# EasyEDA Pro project 复活吧！我们的平衡车！3.30修改后版本.eprj

# Schematic Schematic1
Board Name: Board1; Create Date: 2025-03-22; Page Name: P1; Project Name: 复活吧！我们的平衡车！; Schematic Name: Schematic1; Update Date: 2025-03-22; Company: 嘉立创EDA; Page Size: A4; Version: V1.0
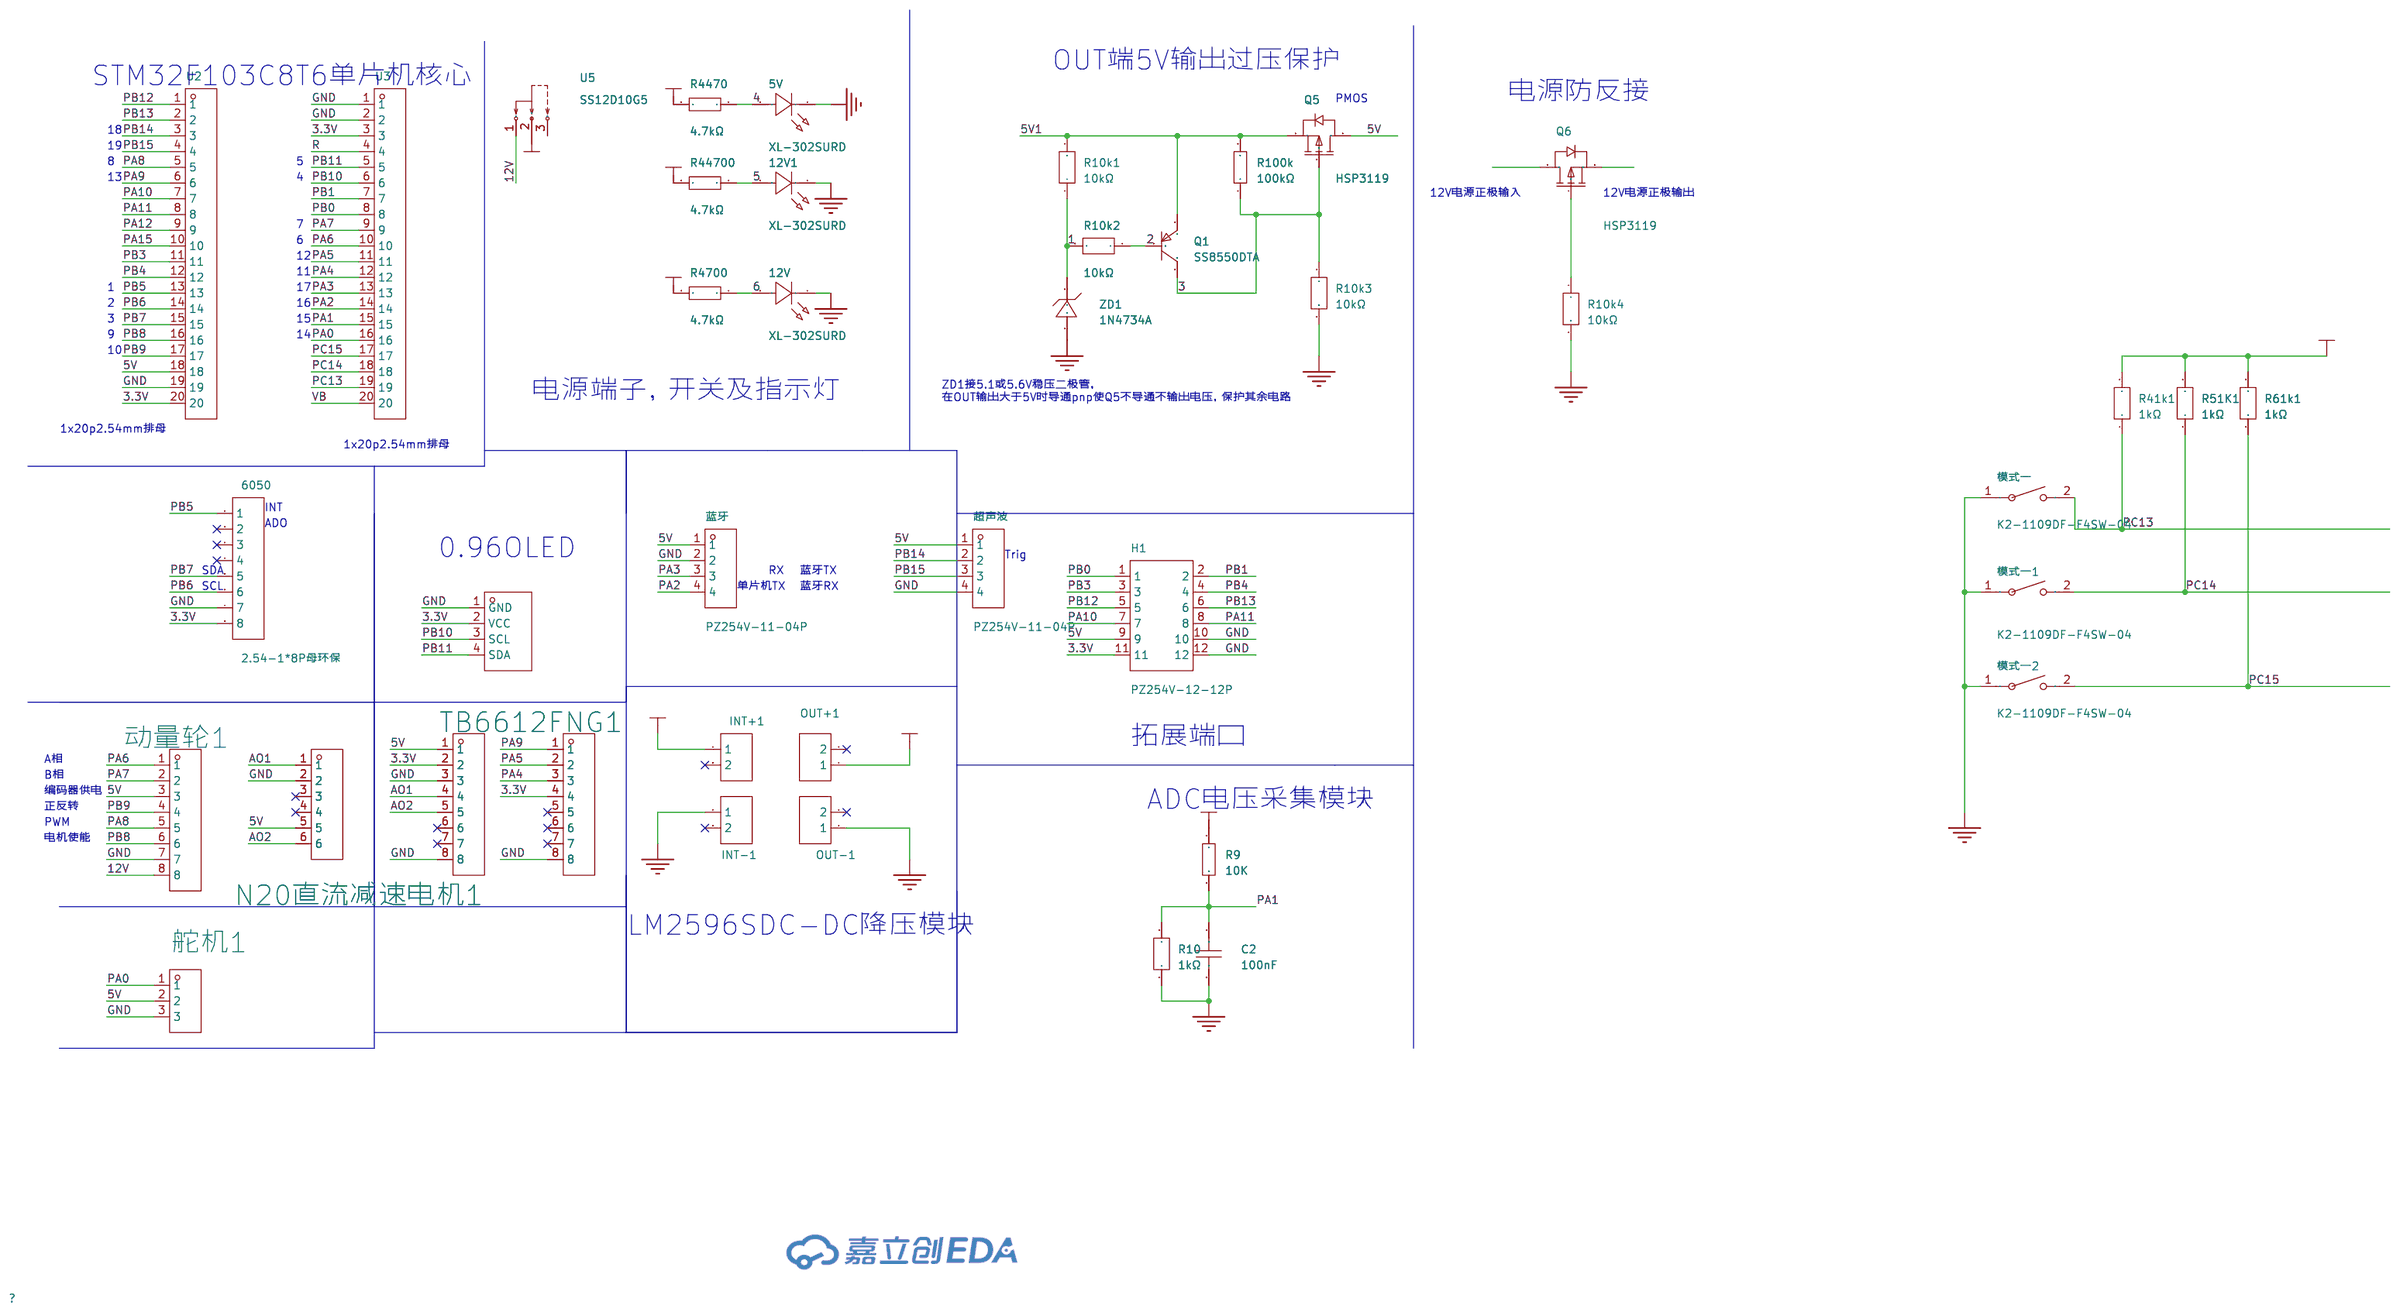
[diagram p0: schematic sheet]

## Parts
5V  XL-302SURD  [LED-TH_BD3.8-P2.54-RD]
12V  XL-302SURD  [LED-TH_BD3.8-P2.54-RD]
12V1  XL-302SURD  [LED-TH_BD3.8-P2.54-RD]
6050  2.54-1*8P母环保  [HDR-TH_8P-P2.54-V-F-1]
C2  100nF  [rad-0.1]
H1  PZ254V-12-12P  [HDR-TH_12P-P2.54-V-M-R2-C6-S2.54]
INT+1  2.54-1*2P母  [HDR-TH_2P-P2.54-V-F]
INT-1  2.54-1*2P母  [HDR-TH_2P-P2.54-V-F]
N20直流减速电机1  KH-2PH90-1X6P-L10.5  [hdr-th_6p-p2.54-v-f]
OLED1  HS96L03W2C03  [OLED-TH_L27.8-W27.2-P2.54_C9900033791]
OUT+1  2.54-1*2P母  [HDR-TH_2P-P2.54-V-F]
OUT-1  2.54-1*2P母  [HDR-TH_2P-P2.54-V-F]
Q1  SS8550DTA  [TO-92-3_L4.8-W3.7-P2.54-L]
Q5  HSP3119  [TO-220-3_L10.2-W4.5-P2.54-L-1]
Q6  HSP3119  [TO-220-3_L10.2-W4.5-P2.54-L-1]
R9  10K  [RES-TH_BD2.3-L6.5-P10.50-D0.5]
R10  1kΩ  [RES-TH_BD2.3-L6.5-P10.50-D0.5]
R10k1  10kΩ  [RES-TH_BD2.4-L6.3-P10.30-D0.6]
R10k2  10kΩ  [RES-TH_BD2.4-L6.3-P10.30-D0.6]
R10k3  10kΩ  [RES-TH_BD2.4-L6.3-P10.30-D0.6]
R10k4  10kΩ  [RES-TH_BD2.4-L6.3-P10.30-D0.6]
R41k1  1kΩ  [RES-TH_BD2.3-L6.5-P10.50-D0.5]
R51K1  1kΩ  [RES-TH_BD2.3-L6.5-P10.50-D0.5]
R61k1  1kΩ  [RES-TH_BD2.3-L6.5-P10.50-D0.5]
R100k  100kΩ  [RES-TH_BD2.7-L6.2-P10.20-D0.4]
R4470  4.7kΩ  [RES-TH_BD2.3-L6.5-P10.50-D0.5]
R4700  4.7kΩ  [RES-TH_BD2.3-L6.5-P10.50-D0.5]
R44700  4.7kΩ  [RES-TH_BD2.3-L6.5-P10.50-D0.5]
TB1  2.54-1*8P/30mm(3+24+3)  [hdr-th_8p-p2.54-v-f]
TB6612FNG1  2.54-1*8P/30mm(3+24+3)  [HDR-TH_8P-P2.54-V-M-4]
U2  KH-2FH-1X20P-H4.3  [hdr-th_20p-p2.54-v-f]
U3  KH-2FH-1X20P-H4.3  [hdr-th_20p-p2.54-v-f]
U5  SS12D10G5  [SW-TH_SHOU-HAN_SS12D10G4]
ZD1  1N4734A  [DO-41_BD2.8-L4.2-P8.00-D0.7-FD]
动量轮1  2.54-1*8P/30mm(3+24+3)  [hdr-th_8p-p2.54-v-f]
模式一  K2-1109DF-F4SW-04  [SW-TH_HRO_K2-1109DF-FXXW-XX]
模式一1  K2-1109DF-F4SW-04  [SW-TH_HRO_K2-1109DF-FXXW-XX]
模式一2  K2-1109DF-F4SW-04  [SW-TH_HRO_K2-1109DF-FXXW-XX]
舵机1  PM254V-11-03-H85  [HDR-TH_3P-P2.54-V-F]
蓝牙  PZ254V-11-04P  [HDR-TH_4P-P2.54-V-M]
超声波  PZ254V-11-04P  [HDR-TH_4P-P2.54-V-M]

## Library data of the parts
5V 12V 12V1 = XL-302SURD: 灯头类型:3mm圆形灯头;发光颜色:红色;功率:80mW;正向电流:30mA;主波长:615nm~620nm;透镜颜色:红色透镜;色温:-;发光角度:50°;载带方式:-;工作温度:-25℃~+85℃;; Supplier Part: C2895470; Manufacturer: XINGLIGHT(成兴光); Supplier Footprint: 插件,D=3mm; JLCPCB Part Class: 扩展库; Datasheet: https://atta.szlcsc.com/upload/public/pdf/source/20240112/E1E2B82945FD635E4907401DDE6D4922.pdf; Supplier: LCSC; Lamp Holder Type: 3mm圆形灯头; Emitted Color: 红色; Power Dissipation: 80mW; Forward Current: 30mA; Dominant Wavelength: 615nm~620nm; Peak Wavelength: 625nm; Lens Color: 红色透镜; Viewing Angle: 50°; Operating Temperature: -25℃~+85℃
6050 = 2.54-1*8P母环保: 插孔结构:1x8P;间距:2.54mm;行距:-;安装类型:直插;排数:单排;总孔位数:8P;塑高:-;触头材质:-;触头镀层:-;; LCSC Part Name: 间距:2.54mm 1x8P 直插; Supplier Part: C27438; Manufacturer: BOOMELE(博穆精密); Supplier Footprint: 插件,P=2.54mm; JLCPCB Part Class: 扩展库; Datasheet: https://atta.szlcsc.com/upload/public/pdf/source/20231221/1CA800C6799ED97958773716FAA1BFFE.pdf; Supplier: LCSC; Holes Structure: 1x8P; Pitch: 2.54mm; Mounting Type: 直插; Number of Rows: 单排; Number of Holes: 8P
C2 = CAP_0603: Supplier Footprint: 0603
H1 = PZ254V-12-12P: 插针结构:2x6P;间距:2.54mm;行距:2.54mm;圆针/方针:方针;安装方式:直插;排数:双排;总PIN位数:12P;额定电流:-;额定电压:-;配合针长度:6mm;塑高:2.5mm;端接针长度:3mm;触头材质:黄铜;触头镀层:-;工作温度:-40℃~+105℃;颜色:黑色;; LCSC Part Name: 2x6P 间距:2.54mm 方针 直插; Supplier Part: C492423; Manufacturer: XFCN(兴飞); Supplier Footprint: 插件,P=2.54mm; JLCPCB Part Class: 扩展库; Datasheet: https://atta.szlcsc.com/upload/public/pdf/source/20200309/C492423_E4E2C9BC0EB9D59A2ABE4377D2E234B2.pdf; Supplier: LCSC; Pin Structure: 2x6P; Pitch: 2.54mm; Row Spacing: 2.54mm; Circluar Pins/Square Pins: 方针; Mounting Type: 直插; Number of Rows: 双排; Number of Pins: 12P; Length of Mating Pin: 6mm; Insulation Height: 2.5mm; Length of End Connection Pin: 3mm; Contact Material: 黄铜; Operating Temperature: -40℃~+105℃; Color: 黑色
INT+1 INT-1 OUT+1 OUT-1 = 2.54-1*2P母: 插孔结构:1x2P;间距:2.54mm;行距:-;安装类型:直插;排数:单排;总孔位数:2P;塑高:-;触头材质:-;触头镀层:-;; LCSC Part Name: 间距:2.54mm 1x2P 直插; Supplier Part: C49661; Manufacturer: BOOMELE(博穆精密); Supplier Footprint: 插件,P=2.54mm; JLCPCB Part Class: 扩展库; Datasheet: https://atta.szlcsc.com/upload/public/pdf/source/20210301/C2718488_F4427B881E42CAA8DDB0B1C12B3A522C.pdf; Supplier: LCSC; Holes Structure: 1x2P; Pitch: 2.54mm; Mounting Type: 直插; Number of Rows: 单排; Number of Holes: 2P
N20直流减速电机1 = KH-2PH90-1X6P-L10.5: 插针结构:1x6P;间距:2mm;行距:-;圆针/方针:方针;安装类型:弯插;排数:单排;总PIN位数:6P;额定电流:1.5A;额定电压:-;配合针长度:4mm;塑高:2mm;端接针长度:-;工作温度范围:-40℃~+105℃;颜色:-;; LCSC Part Name: 间距:2mm 1x6P 弯插 方针; Supplier Part: C2938467; Manufacturer: kinghelm(金航标); Supplier Footprint: 弯插,P=2mm; JLCPCB Part Class: 扩展库; Datasheet: https://atta.szlcsc.com/upload/public/pdf/source/20211228/823CD8A7BB037D772766BAFF43582E23.pdf; Supplier: LCSC; Pin Structure: 1x6P; Pitch: 2mm; Circluar Pins/Square Pins: 方针; Mounting Type: 弯插; Number of Rows: 单排; Number of Pins: 6P; Current Rating (Max): 1.5A; Length of Mating Pin: 4mm; Insulation Height: 2mm; Operating Temperature Range: -40℃~+105℃
OLED1 = HS96L03W2C03: 主控芯片:SSD1315;接口类型:I2C;尺寸(inch):0.96;像素分辨率:128x64;; LCSC Part Name: 0.96寸OLED显示屏窄白光IIC; Supplier Part: C5248080; Manufacturer: HS(汉昇); JLCPCB Part Class: 扩展库; Datasheet: https://atta.szlcsc.com/upload/public/pdf/source/20230627/763D01F79A90007632F098068C7C8AD9.pdf; Supplier: LCSC; Main Control Chip: SSD1315; Interface Type: I2C; Size: 0.96; Pixel Resolution: 128x64; Operating Temperature: -40℃~+70℃
Q1 = SS8550DTA: 晶体管类型:PNP;集电极电流(Ic):1.5A;集射极击穿电压(Vceo):25V;功率(Pd):2W;直流电流增益(hFE@Ic,Vce):40@800mA,1V;; LCSC Part Name: PNP 电流:1.5A 耐压:25V; Supplier Part: C903228; Manufacturer: onsemi(安森美); Supplier Footprint: TO-92-3; JLCPCB Part Class: Extended Part; Datasheet: https://atta.szlcsc.com/upload/public/pdf/source/20221020/9DBCD1C6A257D06DE4F9043ED0140297.pdf; Supplier: LCSC; Transistor Type: PNP; Collector Current (Ic): 1.5A; Collector-Emitter Breakdown Voltage (Vceo): 25V; Power Dissipation (Pd): 2W; DC Current Gain (hFE@Ic,Vce): 40@800mA,1V; Transition Frequency (fT): 100MHz; Collector Cut-Off Current (Icbo): 100nA; Collector-Emitter Saturation Voltage (VCE(sat)@Ic,Ib): 280mV@800mA,80mA; Operating Temperature: -65℃~+150℃
Q5 Q6 = HSP3119: 类型:1个P沟道;漏源电压(Vdss):30V;连续漏极电流(Id):150A;导通电阻(RDS(on)):-;耗散功率(Pd):200W;阈值电压(Vgs(th)):2.5V;; LCSC Part Name: 1个P沟道 耐压:30V 电流:150A; Supplier Part: C22359262; Manufacturer: HUASHUO(华朔); Supplier Footprint: TO-220; JLCPCB Part Class: Extended Part; Datasheet: https://atta.szlcsc.com/upload/public/pdf/source/20240313/B2043F85A28365E5AF5F107A9C9B0F2E.pdf; Supplier: LCSC; Type: 1个P沟道; Drain to Source Voltage: 30V; Current - Continuous Drain(Id): 150A; Pd - Power Dissipation: 200W; Gate Threshold Voltage (Vgs(th)@Id): 2.5V; Input Capacitance(Ciss@Vds): 12.7nF@15V; Reverse Transfer Capacitance (Crss@Vds): 1.21nF@15V; Operating Temperature: -55℃~+150℃@(Tj)
R9 = Res_0603: Supplier Footprint: 0603
R10 R41k1 R51K1 R61k1 = MF1/4W-1KΩ±1%T52: 电阻类型:金属膜电阻;阻值:1kΩ;精度:±1%;功率:250mW;温度系数:±200ppm/℃;; LCSC Part Name: 金属膜电阻 1kΩ ±1% 250mW; Supplier Part: C713997; Manufacturer: 华星机电; Supplier Footprint: 插件; JLCPCB Part Class: 扩展库; Datasheet: https://atta.szlcsc.com/upload/public/pdf/source/20200731/C713882_AE8EB1102749D7E4FB4FB13DC898C429.pdf; Supplier: LCSC; Type: 金属膜电阻; Tolerance: ±1%; Power(Watts): 250mW; Temperature Coefficient: ±200ppm/℃
R10k1-R10k4 = RN1/4W10KFT/BA1: 电阻类型:金属膜电阻;阻值:10kΩ;精度:±1%;功率:250mW;温度系数:±50ppm/℃;; LCSC Part Name: 10kΩ ±1% 250mW 金属膜电阻; Supplier Part: C410695; Manufacturer: Tyohm(幸亚电阻); Supplier Footprint: 插件,D2.4xL6.5mm; JLCPCB Part Class: Extended Part; Datasheet: https://atta.szlcsc.com/upload/public/pdf/source/20190808/C410699_D126E64D28B638F1D73B58E9F61DFD9B.pdf; Supplier: LCSC; Type: 金属膜电阻; Tolerance: ±1%; Overload Voltage (Max): 250V; Power(Watts): 250mW; Temperature Coefficient: ±50ppm/℃; Operating Temperature Range: -55℃~+125℃
R100k = MF1/4W-100K±1%-OT26: 电阻类型:金属膜电阻;阻值:100kΩ;精度:±1%;功率:250mW;温度系数:±350ppm/℃;; LCSC Part Name: 金属膜电阻 100kΩ ±1% 250mW; Supplier Part: C2843019; Manufacturer: VO(翔胜); Supplier Footprint: 插件,D2.7xL6.2mm; JLCPCB Part Class: Extended Part; Datasheet: https://atta.szlcsc.com/upload/public/pdf/source/20200609/C601728_5AA4C0C8E12E11069DA2C3356F29D1F2.pdf; Supplier: LCSC; Type: 金属膜电阻; Tolerance: ±1%; Overload Voltage (Max): 250V; Power(Watts): 250mW; Temperature Coefficient: ±350ppm/℃; Operating Temperature Range: -55℃~+155℃
R4470 R4700 R44700 = 0402WGF4701TCE: 电阻类型:厚膜电阻;阻值:4.7kΩ;精度:±1%;功率:62.5mW;最大工作电压:50V;温度系数:±100ppm/℃;; LCSC Part Name: 4.7kΩ ±1% 62.5mW 厚膜电阻; Supplier Part: C25900; Manufacturer: UNI-ROYAL(厚声); Supplier Footprint: 0402; JLCPCB Part Class: 基础库; Datasheet: https://atta.szlcsc.com/upload/public/pdf/source/20200306/C422600_1E6D84923E4A46A82E41ADD87F860B5C.pdf; Supplier: LCSC; Type: 厚膜电阻; Tolerance: ±1%; Power(Watts): 62.5mW; Overload Voltage (Max): 50V; Temperature Coefficient: ±100ppm/℃; Operating Temperature Range: -55℃~+155℃
TB1 TB6612FNG1 动量轮1 = 2.54-1*8P/30mm(3+24+3): Supplier Part: C9900034496; Supplier Footprint: 2.54-1x8; JLCPCB Part Class: 扩展库; Supplier: LCSC
U2 U3 = KH-2FH-1X20P-H4.3: 插孔结构:1x20P;间距:2mm;行距:-;圆孔/方孔:方孔;安装类型:直插;排数:单排;总孔位数:20P;额定电流:1.5A;额定电压:-;插孔方向:顶部;塑高:4.3mm;工作温度范围:-40℃~+105℃;; LCSC Part Name: 间距:2mm 1x20P 直插; Supplier Part: C2938439; Manufacturer: kinghelm(金航标); Supplier Footprint: 插件,P=2mm; JLCPCB Part Class: 扩展库; Datasheet: https://atta.szlcsc.com/upload/public/pdf/source/20211228/5EC70B7FC510D3D80A3799409C3607F1.pdf; Supplier: LCSC; Holes Structure: 1x20P; Pitch: 2mm; Circular Hole / Square Hole: 方孔; Mounting Type: 直插; Number of Rows: 单排; Number of Holes: 20P; Current Rating (Max): 1.5A; Holes Direction: 顶部; Insulation Height: 4.3mm; Operating Temperature Range: -40℃~+105℃
U5 = SS12D10G5: 电路结构:单刀双掷;安装方式:直插;额定电流(DC):2A;额定电压(DC):125V;机械寿命:3千次;; LCSC Part Name: 两档立式插件 3脚拨动开关 柄长5.0mm; Supplier Part: C7431054; Manufacturer: SHOU HAN(首韩); Supplier Footprint: 插件; JLCPCB Part Class: 扩展库; Datasheet: https://atta.szlcsc.com/upload/public/pdf/source/20231130/7A3DB6A149BF0A1DCFFE64FFC07FE434.pdf; Supplier: LCSC; Circuit: 单刀双掷; Switch Length: 12.7mm; Switch Width: 6.7mm; Mounting Style: 直插; Current Rating (DC): 2A; Voltage Rating (DC): 125V; Mechanical Life: 3千次; Operating Temperature: -25℃~+70℃
ZD1 = 1N4734A_C41430: 二极管配置:独立式;稳压值(标称值):5.6V;耗散功率(Pd):-;; LCSC Part Name: 编带 1N4734A; Supplier Part: C41430; Manufacturer: ST(先科); Supplier Footprint: DO-41; JLCPCB Part Class: Extended Part; Datasheet: https://atta.szlcsc.com/upload/public/pdf/source/20170719/C118641_1500457766301828347.pdf; Supplier: LCSC; Diode Configuration: 独立式; Zener Voltage(Nom): 5.6V; Reverse Leakage Current (Ir): 10uA@2V; Impedance(Zzt): 5Ω
模式一 模式一1 模式一2 = K2-1109DF-F4SW-04: 4.5*4.5*6两脚侧按开关; LCSC Part Name: 4.5*4.5*6两脚侧按开关; Supplier Part: C2909685; Manufacturer: 韩国韩荣; Supplier Footprint: 插件; JLCPCB Part Class: 扩展库; Supplier: LCSC
舵机1 = PM254V-11-03-H85: 插孔结构:1x3P;间距:2.54mm;行距:-;安装类型:直插;排数:单排;总孔位数:3P;塑高:-;触头材质:黄铜;触头镀层:-;; LCSC Part Name: 间距:2.54mm 1x3P 直插; Supplier Part: C541850; Manufacturer: XFCN(兴飞); Supplier Footprint: 插件,P=2.54mm; JLCPCB Part Class: 扩展库; Datasheet: https://atta.szlcsc.com/upload/public/pdf/source/20200518/C541849_85853D71FC67C51915A806977A588FDA.pdf; Supplier: LCSC; Holes Structure: 1x3P; Pitch: 2.54mm; Mounting Type: 直插; Number of Rows: 单排; Number of Holes: 3P; Contact Material: 黄铜
蓝牙 超声波 = PZ254V-11-04P: 插针结构:1x4P;间距:2.54mm;行距:-;圆针/方针:方针;安装类型:直插;排数:单排;总PIN位数:4P;额定电流:3A;额定电压:250V;配合针长度:6mm;塑高:2.5mm;端接针长度:3mm;触头材质:-;工作温度范围:-40℃~+105℃;颜色:黑色;; LCSC Part Name: 间距:2.54mm 1x4P 直插 方针; Supplier Part: C2691448; Manufacturer: XFCN(兴飞); Supplier Footprint: 插件,P=2.54mm; JLCPCB Part Class: Extended Part; Datasheet: https://atta.szlcsc.com/upload/public/pdf/source/20200309/C492403_F9F19131791D08044AD4F84F8E751A34.pdf; Supplier: LCSC; Pin Structure: 1x4P; Pitch: 2.54mm; Circluar Pins/Square Pins: 方针; Mounting Type: 直插; Number of Rows: 单排; Number of Pins: 4P; Current Rating (Max): 3A; Voltage Rating (Max): 250V; Length of Mating Pin: 6mm; Insulation Height: 2.5mm; Length of End Connection Pin: 3mm; Operating Temperature Range: -40℃~+105℃; Color: 黑色

## Nets
3.3V: 6050.8 H1.11 OLED1.2(VCC) R41k1.2 R51K1.2 R61k1.2 TB1.4 TB6612FNG1.2 U2.20 U3.3
5V: H1.9 N20直流减速电机1.5 Q5.2(D) R4470.2 TB6612FNG1.1 U2.18 动量轮1.3 舵机1.2 蓝牙.1 超声波.1
5V1: OUT+1.1 Q1.1(E) Q5.3(S) R10k1.2 R100k.2
12V: INT+1.1 R9.2 R4700.2 U5.1 动量轮1.8
12V1: R44700.2 U5.2
GND: 5V.1(K) 12V.1(K) 12V1.1(K) 6050.7 C2.1 H1.10 H1.12 INT-1.1 N20直流减速电机1.2 OLED1.1(GND) OUT-1.1 R10.1 R10k3.2 R10k4.2 TB1.8 TB6612FNG1.3 TB6612FNG1.8 U2.19 U3.1 U3.2 ZD1.1(A) 动量轮1.7 模式一.1 模式一1.1 模式一2.1 舵机1.3 蓝牙.2 超声波.4
1: R10k1.1 R10k2.2 ZD1.2(K)
2: Q1.2(B) R10k2.1
3: Q1.3(C) Q5.1(G) R10k3.1 R100k.1
4: 5V.2(A) R4470.1
5: 12V1.2(A) R44700.1
6: 12V.2(A) R4700.1
AO1: N20直流减速电机1.1 TB6612FNG1.4
AO2: N20直流减速电机1.6 TB6612FNG1.5
PA0: U3.16 舵机1.1
PA1: C2.2 R9.1 R10.2 U3.15
PA2: U3.14 蓝牙.4
PA3: U3.13 蓝牙.3
PA4: TB1.3 U3.12
PA5: TB1.2 U3.11
PA6: U3.10 动量轮1.1
PA7: U3.9 动量轮1.2
PA8: U2.5 动量轮1.5
PA9: TB1.1 U2.6
PA10: H1.7 U2.7
PA11: H1.8 U2.8
PA12: U2.9
PA15: U2.10
PB0: H1.1 U3.8
PB1: H1.2 U3.7
PB3: H1.3 U2.11
PB4: H1.4 U2.12
PB5: 6050.1 U2.13
PB6: 6050.6 U2.14
PB7: 6050.5 U2.15
PB8: U2.16 动量轮1.6
PB9: U2.17 动量轮1.4
PB10: OLED1.3(SCL) U3.6
PB11: OLED1.4(SDA) U3.5
PB12: H1.5 U2.1
PB13: H1.6 U2.2
PB14: U2.3 超声波.2
PB15: U2.4 超声波.3
PC13: R41k1.1 U3.19 模式一.2
PC14: R51K1.1 U3.18 模式一1.2
PC15: R61k1.1 U3.17 模式一2.2
R: U3.4
VB: U3.20
Net-(Q6-1): Q6.1(G) R10k4.1

Not connected (* = marked no-connect by the designer): 6050 2* 3* 4*; INT+1 2*; INT-1 2*; N20直流减速电机1 3* 4*; OUT+1 2*; OUT-1 2*; Q6 2(D) 3(S); TB1 5* 6* 7*; TB6612FNG1 6* 7*; U5 3

## Notes on the sheet
- OUT端5V输出过压保护
- STM32F103C8T6单片机核心
- PMOS
- 电源防反接
- 18
- 19
- 8
- 5
- 13
- 4
- 12V电源正极输入
- 12V电源正极输出
- 7
- 6
- 11
- 12
- 1
- 17
- 2
- 16
- 3
- 15
- 9
- 14
- 10
- 电源端子，开关及指示灯
- ZD1接5.1或5.6V稳压二极管，
  在OUT输出大于5V时导通pnp使Q5不导通不输出电压，保护其余电路
- 1x20p2.54mm排母
- 1x20p2.54mm排母
- INT
- ADO
- SDA
- 0.96OLED
- RX
- 蓝牙TX
- Trig
- SCL
- 单片机TX
- 蓝牙RX
- 拓展端口
- A相
- B相
- 编码器供电
- 正反转
- ADC电压采集模块
- PWM
- 电机使能
- LM2596SDC-DC降压模块

# Board PCB1
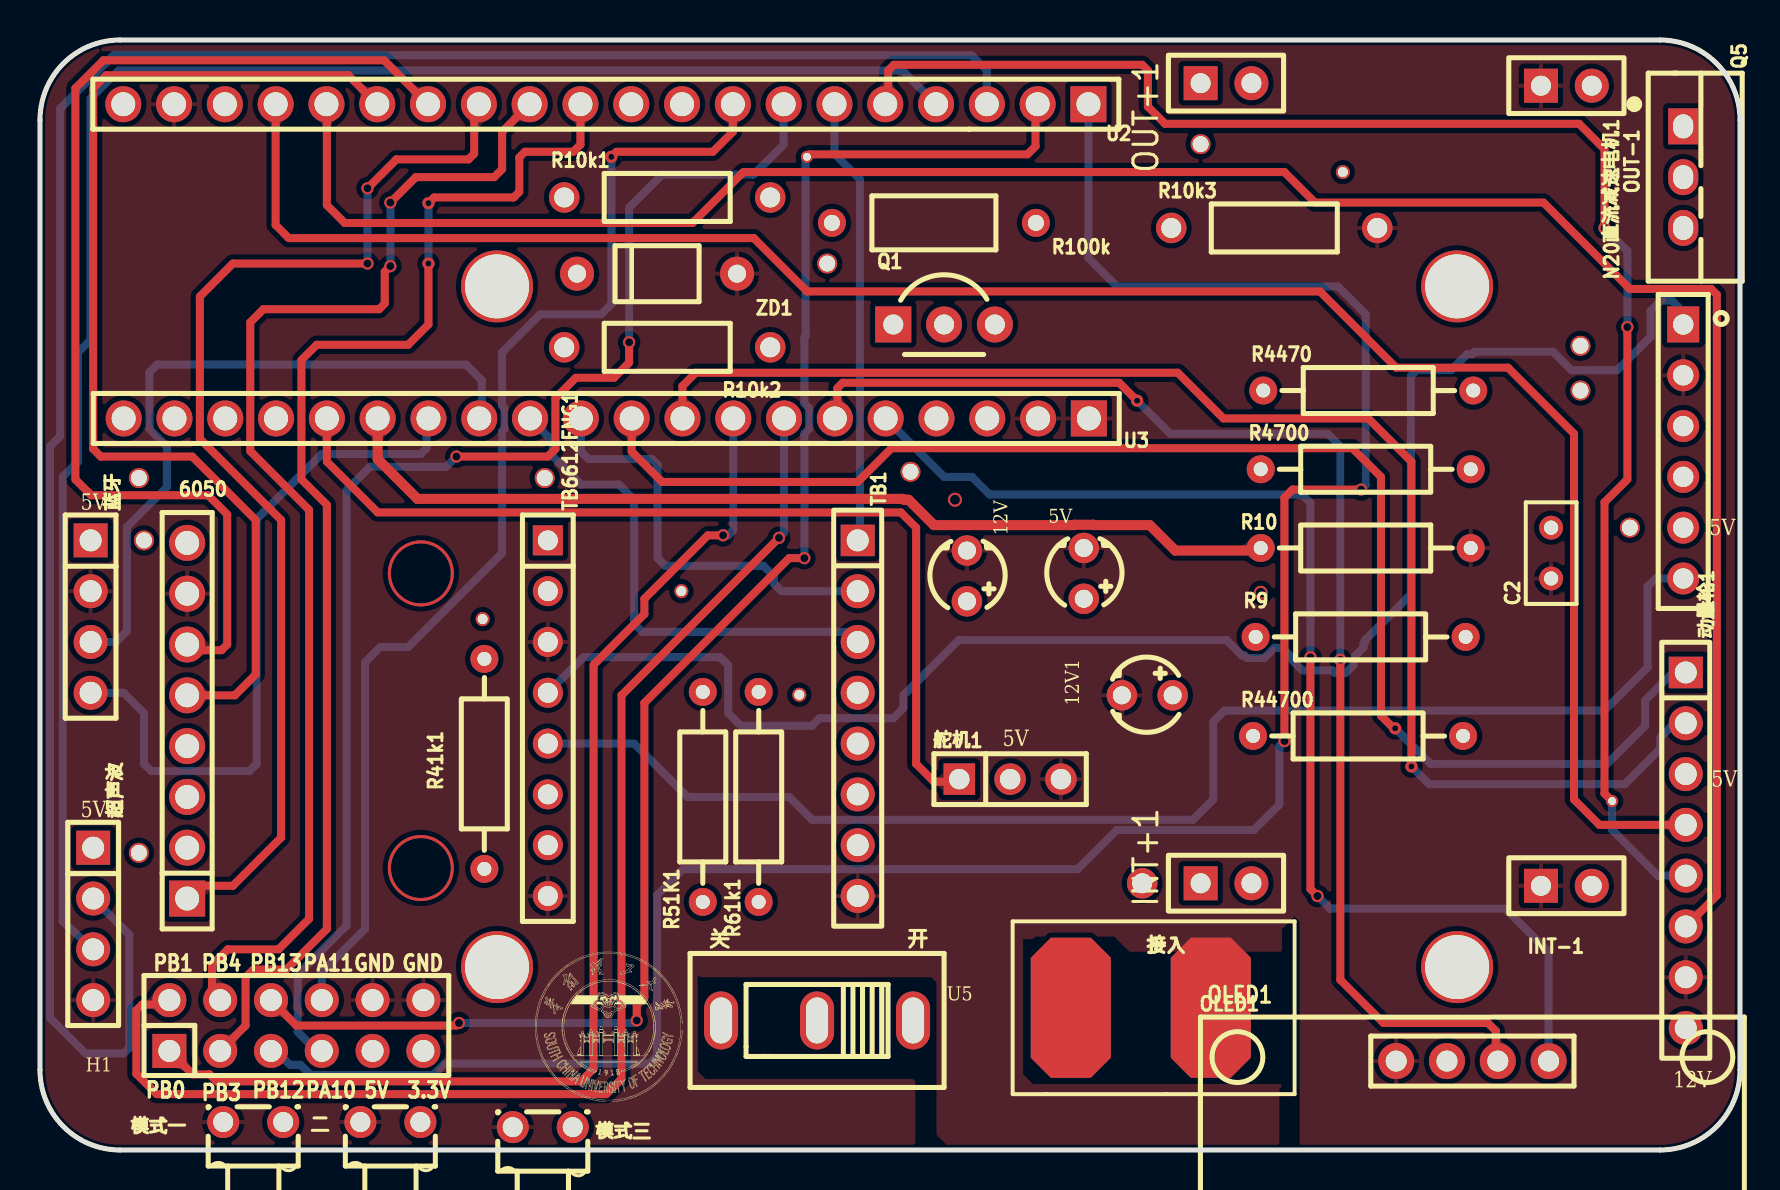
[diagram p1: board, top side]
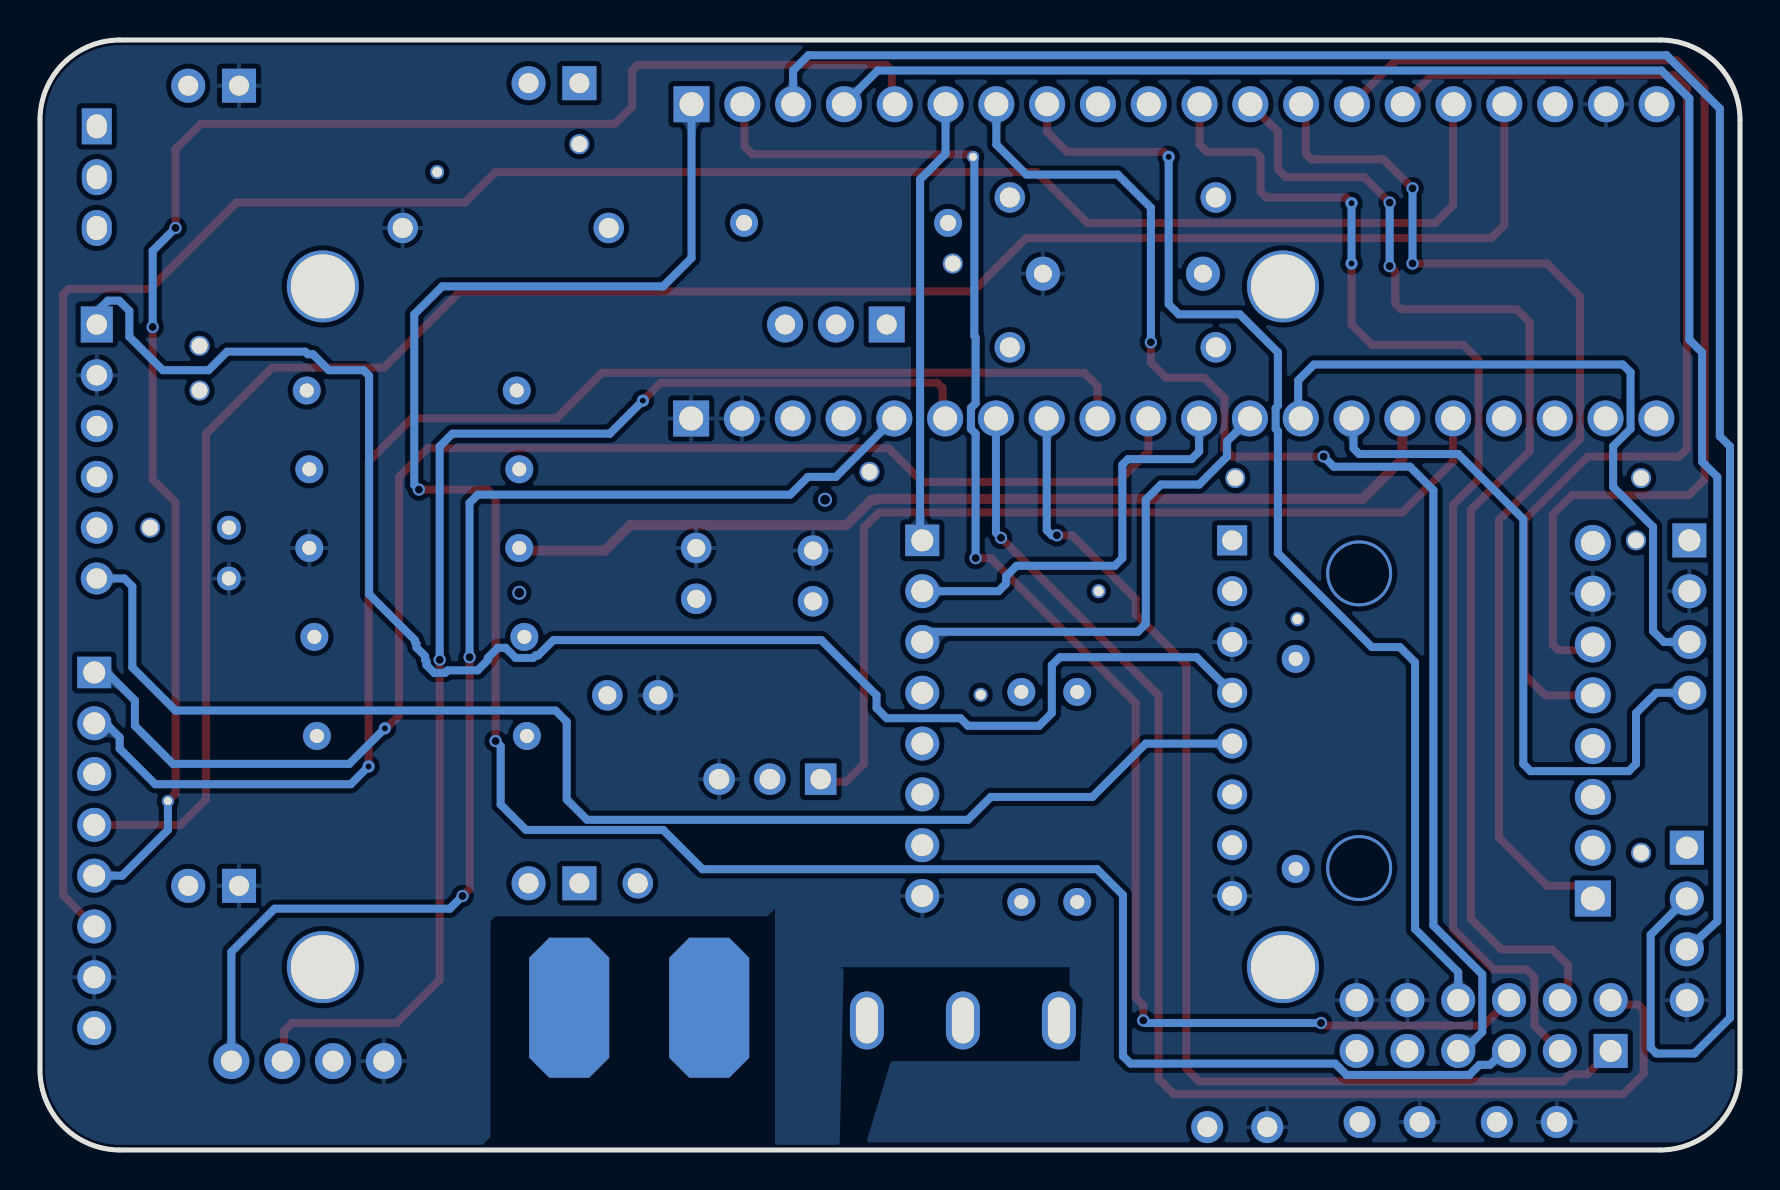
[diagram p2: board, bottom side, seen from below]

Outline 85 x 55.5 mm; copper layers: Top Layer, Inner1, Inner2, Bottom Layer. Coordinates in mm from the lower left corner of the outline.
Outline path: 0,51.5 0,4 arc(1.17,1.17) 4,0 81,0 arc(83.83,1.17) 85,4 85,51.5 arc(83.83,54.33) 81,55.5 4,55.5 arc(1.17,54.33) 0,51.5
Stack: Top Layer 0.035mm 外层铜厚1oz / Dielectric1 0.2104mm 7628 RC49% 8.6mil / Inner1 0.0152mm 内层铜厚 / Dielectric2 1.065mm 1.1mm H/HOZ Copper / Inner2 0.0152mm 内层铜厚 / Dielectric3 0.2104mm 7628 RC49% 8.6mil / Bottom Layer 0.035mm 外层铜厚1oz

## Design rules (mm)
template: 自定义配置
spacing copperThickness1oz (default): track to track 0.102, other pairs 0.152 to 0.3
spacing copperThickness2oz: track to track 0.203, other pairs 0.152 to 0.3
track width copperThickness1oz (default): min 0.4, default 0.4, max 1.5
track width copperThickness2oz: min 0.203, default 0.254, max 2.54
differential pair differentialPair (default): width min 0.127, default 0.254, max 2.54; gap min 0.152, default 0.152
via viaSize (default): diameter min 0.5, default 0.61, max 10; hole min 0.3, default 0.305, max 6.3

## Placement (name value [footprint] x y rotation side)
5V  XL-302SURD  [LED-TH_BD3.8-P2.54-RD]  52.19 28.83 270 top
12V  XL-302SURD  [LED-TH_BD3.8-P2.54-RD]  46.35 28.7 270 top
12V1  XL-302SURD  [LED-TH_BD3.8-P2.54-RD]  55.36 22.73 0 top
6050  2.54-1*8P母环保  [HDR-TH_8P-P2.54-V-F-1]  7.36 21.46 90 top
C2  100nF  [rad-0.1]  75.56 29.85 90 top
H1  PZ254V-12-12P  [HDR-TH_12P-P2.54-V-M-R2-C6-S2.54]  12.82 6.22 0 top
INT+1  2.54-1*2P母  [HDR-TH_2P-P2.54-V-F]  59.3 13.34 0 top
INT-1  2.54-1*2P母  [HDR-TH_2P-P2.54-V-F]  76.32 13.21 0 top
N20直流减速电机1  KH-2PH90-1X6P-L10.5  [hdr-th_6p-p2.54-v-f]  82.16 34.93 270 top
NOREF  -  [Pad_e34]  70.86 43.18 0 top
NOREF#2  -  [Pad_e625]  37.97 22.76 0 top
NOREF#3  -  [Pad_e389]  4.94 14.86 0 top
NOREF#4  -  [Pad_e2376]  22.13 26.54 0 top
NOREF#5  -  [Pad_e343]  77.02 37.97 0 top
NOREF#6  -  [Pad_e1487]  78.6 17.44 0 top
NOREF#7  -  [Pad_e35]  70.86 9.14 0 top
NOREF#8  -  [Pad_e325]  58.03 50.29 0 top
NOREF#9  -  [Pad_e492]  43.52 33.91 0 top
NOREF#10  -  [Pad_e390]  5.2 30.48 0 top
NOREF#11  -  [Pad_e388]  25.24 33.6 0 top
NOREF#12  -  [Pad_e32]  22.85 9.14 0 top
NOREF#13  -  [Pad_e502]  79.49 31.12 0 top
NOREF#14  -  [Pad_e307]  39.36 44.32 0 top
NOREF#15  -  [Pad_e33]  22.85 43.18 0 top
NOREF#16  -  [Pad_e410]  4.94 33.6 0 top
NOREF#17  -  [Pad_e1902]  38.35 49.66 0 top
NOREF#18  -  [Pad_e766]  65.14 48.9 0 top
NOREF#19  -  [Pad_e344]  77.02 40.21 0 top
NOREF#20  -  [Pad_e176]  55.11 13.34 0 top
NOREF#21  -  [Pad_e604]  32.07 27.94 0 top
OLED1  HS96L03W2C03  [OLED-TH_L27.8-W27.2-P2.54_C9900033791]  71.62 4.45 0 top
OUT+1  2.54-1*2P母  [HDR-TH_2P-P2.54-V-F]  59.3 53.34 0 top
OUT-1  2.54-1*2P母  [HDR-TH_2P-P2.54-V-F]  76.32 53.21 0 top
Q1  SS8550DTA  [TO-92-3_L4.8-W3.7-P2.54-L]  45.2 41.28 0 top
Q5  HSP3119  [TO-220-3_L10.2-W4.5-P2.54-L-1]  82.16 48.64 270 top
R9  10K  [RES-TH_BD2.3-L6.5-P10.50-D0.5]  66.03 25.66 0 top
R10  1kΩ  [RES-TH_BD2.3-L6.5-P10.50-D0.5]  66.29 30.1 180 top
R10k1  10kΩ  [RES-TH_BD2.4-L6.3-P10.30-D0.6]  31.36 47.63 0 top
R10k2  10kΩ  [RES-TH_BD2.4-L6.3-P10.30-D0.6]  31.36 40.13 180 top
R10k3  10kΩ  [RES-TH_BD2.4-L6.3-P10.30-D0.6]  61.71 46.1 0 top
R41k1  1kΩ  [RES-TH_BD2.3-L6.5-P10.50-D0.5]  22.22 19.31 90 top
R51K1  1kΩ  [RES-TH_BD2.3-L6.5-P10.50-D0.5]  33.14 17.65 90 top
R61k1  1kΩ  [RES-TH_BD2.3-L6.5-P10.50-D0.5]  35.93 17.65 90 top
R100k  100kΩ  [RES-TH_BD2.7-L6.2-P10.20-D0.4]  44.7 46.36 180 top
R4470  4.7kΩ  [RES-TH_BD2.3-L6.5-P10.50-D0.5]  66.41 37.97 0 top
R4700  4.7kΩ  [RES-TH_BD2.3-L6.5-P10.50-D0.5]  66.29 34.04 0 top
R44700  4.7kΩ  [RES-TH_BD2.3-L6.5-P10.50-D0.5]  65.91 20.7 0 top
TB1  2.54-1*8P/30mm(3+24+3)  [hdr-th_8p-p2.54-v-f]  40.89 21.59 270 top
TB6612FNG1  2.54-1*8P/30mm(3+24+3)  [HDR-TH_8P-P2.54-V-M-4]  25.39 21.59 270 top
U2  KH-2FH-1X20P-H4.3  [hdr-th_20p-p2.54-v-f]  28.29 52.29 180 top
U3  KH-2FH-1X20P-H4.3  [hdr-th_20p-p2.54-v-f]  28.31 36.58 180 top
U5  SS12D10G5  [SW-TH_SHOU-HAN_SS12D10G4]  38.85 6.48 180 top
ZD1  1N4734A  [DO-41_BD2.8-L4.2-P8.00-D0.7-FD]  30.85 43.82 180 top
二  K2-1109DF-F4SW-04  [SW-TH_HRO_K2-1109DF-FXXW-XX]  17.52 1.4 0 top
动量轮1  2.54-1*8P/30mm(3+24+3)  [hdr-th_8p-p2.54-v-f]  82.29 14.99 270 top
接入  Header 2  [T接头]  58.54 7.11 270 top
模式一  K2-1109DF-F4SW-04  [SW-TH_HRO_K2-1109DF-FXXW-XX]  10.66 1.4 0 top
模式三  K2-1109DF-F4SW-04  [SW-TH_HRO_K2-1109DF-FXXW-XX]  25.14 1.14 0 top
舵机1  PM254V-11-03-H85  [HDR-TH_3P-P2.54-V-F]  48.51 18.54 0 top
蓝牙  PZ254V-11-04P  [HDR-TH_4P-P2.54-V-M]  2.53 26.67 270 top
超声波  PZ254V-11-04P  [HDR-TH_4P-P2.54-V-M]  2.66 11.3 270 top

## Footprints (pads in the part's own frame, mm; a bottom-side part is the same pattern mirrored in y, then rotated)
DO-41_BD2.8-L4.2-P8.00-D0.7-FD
  round 1.7 hole 0.9: 1(-4,0) 2(4,0)
HDR-TH_2P-P2.54-V-F
  rect 1.7x1.7 hole 1: 1(-1.27,0)
  round 1.7 hole 1: 2(1.27,0)
HDR-TH_3P-P2.54-V-F
  rect 1.575x1.575 hole 1.02: 1(-2.54,0)
  round 1.575 hole 1.02: 2(0,0) 3(2.54,0)
HDR-TH_4P-P2.54-V-M
  rect 1.7x1.7 hole 1.1: 1(-3.81,0)
  round 1.7 hole 1.1: 2(-1.27,0) 3(1.27,0) 4(3.81,0)
hdr-th_6p-p2.54-v-f
  rect 1.8x1.6 hole 1.02: 1(-6.35,0)
  round 1.6 hole 1.02: 2(-3.81,0) 3(-1.27,0) 4(1.27,0) 5(3.81,0) 6(6.35,0)
hdr-th_8p-p2.54-v-f
  rect 1.575x1.7 hole 1.1: 1(-8.89,0)
  round 1.7 hole 1.1: 2(-6.35,0) 3(-3.81,0) 4(-1.27,0) 5(1.27,0) 6(3.81,0) 7(6.35,0) 8(8.89,0)
HDR-TH_8P-P2.54-V-F-1
  rect 1.8x1.8 hole 1.2: 1(-8.89,0)
  round 1.8 hole 1.2: 2(-6.35,0) 3(-3.81,0) 4(-1.27,0) 5(1.27,0) 6(3.81,0) 7(6.35,0) 8(8.89,0)
HDR-TH_8P-P2.54-V-M-4
  rect 1.5x1.5 hole 1: 1(-8.89,0)
  round 1.5 hole 1: 2(-6.35,0) 3(-3.81,0) 4(-1.27,0) 5(1.27,0) 6(3.81,0) 7(6.35,0) 8(8.89,0)
HDR-TH_12P-P2.54-V-M-R2-C6-S2.54
  rect 1.7x1.7 hole 1.1: 1(-6.35,-1.27)
  round 1.7 hole 1.1: 2(-6.35,1.27) 3(-3.81,-1.27) 4(-3.81,1.27) 5(-1.27,-1.27) 6(-1.27,1.27) 7(1.27,-1.27) 8(1.27,1.27) 9(3.81,-1.27) 10(3.81,1.27) 11(6.35,-1.27) 12(6.35,1.27)
hdr-th_20p-p2.54-v-f
  rect 1.8x1.8 hole 1.2: 1(-24.13,0)
  round 1.8 hole 1.2: 2(-21.59,0) 3(-19.05,0) 4(-16.51,0) 5(-13.97,0) 6(-11.43,0) 7(-8.89,0) 8(-6.35,0) 9(-3.81,0) 10(-1.27,0) 11(1.27,0) 12(3.81,0) 13(6.35,0) 14(8.89,0) 15(11.43,0) 16(13.97,0) 17(16.51,0) 18(19.05,0) 19(21.59,0) 20(24.13,0)
LED-TH_BD3.8-P2.54-RD
  round 1.524 hole 0.9: 1(-1.27,0) 2(1.27,0)
OLED-TH_L27.8-W27.2-P2.54_C9900033791
  round 1.8 hole 1.05: 1(-3.81,0) 2(-1.27,0) 3(1.27,0) 4(3.81,0)
Pad_e32
  round 3.6 hole 3.2: (0,0)
Pad_e33
  round 3.6 hole 3.2: (0,0)
Pad_e34
  round 3.6 hole 3.2: (0,0)
Pad_e35
  round 3.6 hole 3.2: (0,0)
Pad_e176
  round 1.524 hole 1: 1(0,0)
Pad_e307
  round 1 hole 0.8: 1(0,0)
Pad_e325
  round 1 hole 0.8: 1(0,0)
Pad_e343
  round 1 hole 0.8: 1(0,0)
Pad_e344
  round 1 hole 0.8: 2(0,0)
Pad_e388
  round 1 hole 0.8: 1(0,0)
Pad_e389
  round 1 hole 0.8: 2(0,0)
Pad_e390
  round 1 hole 0.8: 3(0,0)
Pad_e410
  round 1 hole 0.8: 1(0,0)
Pad_e492
  round 1 hole 0.8: 1(0,0)
Pad_e502
  round 1 hole 0.8: 1(0,0)
Pad_e604
  round 0.7 hole 0.5: 1(0,0)
Pad_e625
  round 0.7 hole 0.5: 1(0,0)
Pad_e766
  round 0.7 hole 0.5: 1(0,0)
Pad_e1487
  round 0.6 hole 0.4: 1(0,0)
Pad_e1902
  round 0.6 hole 0.4: 1(0,0)
Pad_e2376
  round 0.7 hole 0.5: 1(0,0)
rad-0.1
  round 1.194 hole 0.711: 1(-1.27,0) 2(1.27,0)
RES-TH_BD2.3-L6.5-P10.50-D0.5
  round 1.4 hole 0.7: 1(-5.25,0) 2(5.25,0)
RES-TH_BD2.4-L6.3-P10.30-D0.6
  round 1.524 hole 1: 1(-5.15,0) 2(5.15,0)
RES-TH_BD2.7-L6.2-P10.20-D0.4
  round 1.4 hole 0.8: 1(-5.1,0) 2(5.1,0)
SW-TH_HRO_K2-1109DF-FXXW-XX
  round 1.6 hole 1: 1(-1.5,0) 2(1.5,0)
SW-TH_SHOU-HAN_SS12D10G4
  oval 1.7x2.9 hole 1.1x2.3: 1(-4.8,0) 2(0,0) 3(4.8,0)
TO-92-3_L4.8-W3.7-P2.54-L
  rect 1.8x1.8 hole 1: 1(-2.54,0)
  round 1.8 hole 1: 2(0,0) 3(2.54,0)
TO-220-3_L10.2-W4.5-P2.54-L-1
  rect 1.8x1.5 hole 1.2x1: 1(-2.54,0)
  oval 1.8x1.5 hole 1.2x1: 2(0,0) 3(2.54,0)
T接头
  custom 7x4 hole 2x5: 1(0,0)
  custom 7x4 hole 5x2: 2(0,-7)

## Nets
3.3V: 6050.8 H1.11 NOREF#2.1 NOREF#4.1 NOREF#21.1 OLED1.2 R41k1.2 R51K1.2 R61k1.2 TB1.4 TB6612FNG1.2 U2.20 U3.3
5V: H1.9 N20直流减速电机1.5 NOREF#3.2 NOREF#5.1 NOREF#9.1 NOREF#10.3 NOREF#11.1 NOREF#13.1 NOREF#16.1 NOREF#19.2 Q5.2 R4470.2 TB6612FNG1.1 U2.18 动量轮1.3 舵机1.2 蓝牙.1 超声波.1
5V1: NOREF#8.1 NOREF#14.1 OUT+1.1 Q1.1 Q5.3 R10k1.2 R100k.2
12V: INT+1.1 NOREF#20.1 R9.2 R4700.2 U5.1 动量轮1.8
12V1: R44700.2 U5.2 接入.2
GND: 5V.1 12V.1 12V1.1 6050.7 C2.1 H1.10 H1.12 INT-1.1 N20直流减速电机1.2 OLED1.1 OUT-1.1 R10.1 R10k3.2 TB1.8 TB6612FNG1.3 TB6612FNG1.8 U2.19 U3.1 U3.2 ZD1.1 二.1 动量轮1.7 接入.1 模式一.1 模式三.1 舵机1.3 蓝牙.2 超声波.4
1: R10k1.1 R10k2.2 ZD1.2
2: Q1.2 R10k2.1
3: NOREF#18.1 Q1.3 Q5.1 R10k3.1 R100k.1
4: 5V.2 R4470.1
5: 12V1.2 R44700.1
6: 12V.2 R4700.1
AO1: N20直流减速电机1.1 TB6612FNG1.4
AO2: N20直流减速电机1.6 TB6612FNG1.5
PA0: U3.16 舵机1.1
PA1: C2.2 R9.1 R10.2 U3.15
PA2: U3.14 蓝牙.4
PA3: U3.13 蓝牙.3
PA4: TB1.3 U3.12
PA5: TB1.2 U3.11
PA6: U3.10 动量轮1.1
PA7: U3.9 动量轮1.2
PA8: NOREF#6.1 U2.5 动量轮1.5
PA9: TB1.1 U2.6
PA10: H1.7 U2.7
PA11: H1.8 U2.8
PA12: U2.9
PA15: U2.10
PB0: H1.1 U3.8
PB1: H1.2 U3.7
PB3: H1.3 U2.11
PB4: H1.4 U2.12
PB5: 6050.1 U2.13
PB6: 6050.6 U2.14
PB7: 6050.5 U2.15
PB8: U2.16 动量轮1.6
PB9: U2.17 动量轮1.4
PB10: OLED1.3 U3.6
PB11: OLED1.4 U3.5
PB12: H1.5 U2.1
PB13: H1.6 NOREF#17.1 U2.2
PB14: U2.3 超声波.2
PB15: U2.4 超声波.3
PC13: R41k1.1 U3.19 模式一.2
PC14: R51K1.1 U3.18 二.2
PC15: R61k1.1 U3.17 模式三.2
R: U3.4
VB: U3.20

Pads without a net: 6050 2 3 4; INT+1 2; INT-1 2; N20直流减速电机1 3 4; OUT+1 2; OUT-1 2; TB1 5 6 7; TB6612FNG1 6 7; U5 3

## Via types
v1: diameter 3.3, hole 3, Top Layer to Bottom Layer, 2 vias
v2: diameter 0.61, hole 0.4, Top Layer to Bottom Layer, 18 vias
v3: diameter 0.7, hole 0.5, Top Layer to Bottom Layer, 2 vias
v4: diameter 0.61, hole 0.305, Top Layer to Bottom Layer, 6 vias

## Routing (per net, layer and track width the routed paths; a pad name or vN(x,y) marks a point on that pad's centre or on a via; arc(x,y) is an arc through that point)
3.3V: length 270.1
  Inner1 w0.5: NOREF#4.1 13.71,26.54 10.15,30.1 7.48,30.1 7.36,30.23 6050.8 ; NOREF#4.1 22.13,24.64 R41k1.2 ; NOREF#4.1 22.72,26.54 24,27.81 25.26,27.81 TB6612FNG1.2 NOREF#21.1 36.95,27.94 37.97,26.92 NOREF#2.1 ; U2.20 4.16,53.83 4.44,54.1 54.35,54.1 54.86,53.59 54.86,50.77 54.5,50.42 32.88,50.42 31.74,49.28 31.74,39.88 33.14,38.48 46.85,38.48 47.36,37.97 U3.3 ; TB1.4 40.79,22.76 NOREF#2.1 ; NOREF#2.1 37.82,22.9 R61k1.2 R51K1.2 ; NOREF#2.1 37.97,12.07 36.57,10.67 28.94,10.67 28.44,10.17 28.44,4.7 28.09,4.35 19.78,4.35 H1.11
  Inner2 w0.5: v3(45.75,32.51) 33.65,32.51 32.12,30.99 32.12,28.07 ; v3(45.75,32.51) 46.85,32.51 47.36,33.02 U3.3 ; v3(45.75,32.51) 45.75,31.59 45.84,31.5 65.52,31.5 66.75,30.28 66.75,29.64 68.44,27.94 72.64,27.94 74.54,26.04 74.54,19.69 73.02,18.16 73.02,11.69 74.16,10.54 74.16,7.88 72.64,6.35 70.73,6.35 70.35,5.97 OLED1.2
5V: length 222.9
  Inner1 w0.8: NOREF#13.1 79.49,19.56 80.26,18.8 动量轮1.3 ; NOREF#13.1 79.49,35.05 77.02,37.52 NOREF#19.2 ; NOREF#13.1 N20直流减速电机1.5 ; NOREF#16.1 2.21,33.6 1.64,34.16 1.64,46.61 3.04,48.01 8.57,48.01 9.24,48.68 U2.18 ; NOREF#16.1 5.25,33.29 5.25,30.48 5.23,30.48 5.23,15.01 4.94,14.73 ; NOREF#16.1 NOREF#11.1 ; NOREF#11.1 25.39,33.44 TB6612FNG1.1 ; NOREF#11.1 25.55,33.91 NOREF#9.1 ; 4.94,14.73 4.82,14.6 4.82,3.81 5.33,3.3 16.38,3.3 16.64,3.57 16.64,4.97 ; 4.94,14.73 4.56,15.11 2.91,15.11 2.79,14.99 ; 5.16,30.42 5.21,30.47 ; Q5.2 83.94,46.86 83.94,44.64 83.12,43.82 77.59,43.82 77.02,43.25 NOREF#19.2 ; NOREF#19.2 66.08,40.21 65.91,40.39 60.82,40.39 56.38,35.94 56.38,34.48 55.81,33.91 NOREF#9.1 ; NOREF#9.1 43.52,24.67 45.2,22.99 47.94,22.99 48.51,22.42 舵机1.2 ; NOREF#10.3 2.53,30.48 ; R4470.2 NOREF#5.1
5V1: length 63.2
  Inner1 w0.8: 58.03,53.34 NOREF#8.1 ; NOREF#8.1 56.38,48.64 40.4,48.64 39.6,47.84 R100k.2 39.36,46.12 NOREF#14.1 ; NOREF#8.1 76.45,50.29 80.64,46.1 Q5.3 ; 36.51,47.37 36.51,45.14 37.33,44.32 NOREF#14.1 ; NOREF#14.1 39.39,44.32 39.39,42.14 40.25,41.28 Q1.1
12V: length 91.9
  Inner1 w1.2: 77.34,15.88 77.34,31.88 75.18,34.04 R4700.2 ; 74.44,15.62 79.37,15.62 80.22,14.77 80.22,7.11 81.23,6.1 82.29,6.1 ; 74.44,15.62 74.44,24.36 73.14,25.66 R9.2 ; 74.44,15.62 55.87,15.62 55.11,14.86 NOREF#20.1 ; U5.1 43.65,8.38 45.71,10.44 45.71,12.14 46.91,13.34 NOREF#20.1 ; NOREF#20.1 58.03,13.34
12V1: length 64.6
  Inner1 w1.2: U5.2 38.85,2.93 39.75,2.03 50.44,2.03 51.54,3.14 接入.2
  Inner2 w1.2: U5.2 38.85,6.6 43.3,11.05 43.3,14.48 44.7,15.88 53.21,15.88 53.49,16.16 53.49,17.94 54.09,18.54 66.41,18.54 67.43,17.53 70.35,17.53 71.03,18.2 71.03,20.58 R44700.2
(no net):
  vias: v1(19.04,28.83) v1(19.04,14.1)
1: length 8
  Inner1 w0.5: 26.21,40.13 26.85,40.78 ZD1.2 26.85,46.98 26.21,47.63
2: length 10.4
  Inner1 w0.5: R10k2.1 37.15,39.5 44.7,39.5 45.05,39.85 45.05,41.12 Q1.2
3: length 49.1
  Inner1 w0.5: NOREF#18.1 65.14,48.52 63.08,46.45 56.92,46.45 R10k3.1 56.56,41.84 55.75,41.02 48,41.02 Q1.3 47.74,43.05 48.63,43.94 49.65,43.94 49.8,44.09 R100k.1
  Inner2 w0.5: NOREF#18.1 65.14,50.83 65.5,51.18 Q5.1
4: length 22.2
  Inner1 w0.5: R4470.1 63.37,37.97 64.25,37.08 64.25,32.5 63.75,32 59.81,32 55.36,27.56 5V.2
5: length 6
  Inner1 w1.2: R44700.1 60.66,22.14 59.68,23.11 57.01,23.11 12V1.2
6: length 19.4
  Inner1 w1.2: R4700.1 58.79,34.04 56.76,32 49.86,32 49.01,31.16 49.01,27.94 48.47,27.4 46.32,27.4
AO1: length 80.5
  Bottom Layer w0.4: N20直流减速电机1.1 82.16,41.91 81.6,42.47 81.04,42.47 80.53,41.96 80.53,40.66 78.86,38.99 76.57,38.99 75.65,39.92 71.74,39.92 71.61,39.79 71.35,39.79 70.56,38.99 68.83,38.99 68.54,38.71 68.54,27.78 66.25,25.5 66.25,25.4 66.18,25.32 66.18,25.13 65.74,24.69 65.74,24.51 65.67,24.44 65.67,24.24 65.29,23.86 64.74,23.86 64.62,23.98 63.12,23.98 62.61,24.49 62.61,24.61 62.11,25.11 61.73,25.11 61.22,24.6 60.35,24.6 60.22,24.73 60.09,24.73 59.33,25.49 45.93,25.49 43.17,22.73 43.17,22.1 42.66,21.59 38.98,21.59 38.6,21.21 35.04,21.21 34.41,21.84 34.41,24.24 34.01,24.64 27.17,24.64 TB6612FNG1.4
AO2: length 68
  Bottom Layer w0.4: TB6612FNG1.5 29.71,20.32 32.38,17.65 37.46,17.65 38.6,16.51 57.65,16.51 58.67,17.53 58.67,21.42 59.22,21.97 78.22,21.97 80.38,24.13 80.38,28.18 80.78,28.58 N20直流减速电机1.6
PA0: length 47.4
  Top Layer w0.4: 舵机1.1 45.84,18.42 44.7,18.42 43.81,19.31 43.81,31.12 43.04,31.88 16.88,31.88 14.34,34.42 14.34,36.58
PA1: length 69.8
  Top Layer w0.5: 16.88,36.58 16.88,34.55 18.87,32.56 43.15,32.56 43.19,32.51 43.43,32.51 44.7,31.24 51.69,31.24 51.71,31.26 52.67,31.26 52.69,31.24 55.49,31.24 56.76,29.97 60.91,29.97 R10.2
  Inner1 w0.5: v3(61.04,27.86) 61.04,25.91 R9.1 ; v3(61.04,27.86) R10.2 ; v3(61.04,27.86) 73.19,27.86 73.78,28.45 73.78,30.64 74.13,30.99 75.43,30.99 C2.2
PA2: length 35.3
  Bottom Layer w0.4: 蓝牙.4 4.18,22.86 5.2,21.84 5.2,19.31 5.56,18.94 10.47,18.94 10.83,19.31 10.83,31.55 14.09,34.8 19.04,34.8 19.32,35.08 19.32,36.48 U3.14
PA3: length 35.2
  Bottom Layer w0.4: 2.53,25.4 3.8,25.4 4.35,25.95 4.35,31.15 6.34,33.15 6.34,35.19 5.47,36.06 5.47,38.88 5.86,39.27 21.3,39.27 22.09,38.48 22.09,36.7 U3.13
PA4: length 25.1
  Bottom Layer w0.4: TB1.3 40.38,25.91 30.11,25.91 29.71,26.31 29.71,32.51 28.95,33.28 27.04,33.28 25.65,34.67 25.65,35.43 U3.12
PA5: length 21.3
  Bottom Layer w0.4: TB1.2 37.08,27.94 36.69,28.32 36.69,28.68 36.17,29.21 31.26,29.21 30.88,29.59 30.88,34.26 30.6,34.55 27.42,34.55 27.04,34.93 27.04,36.58
PA6: length 71.9
  Top Layer w0.4: v4(67.76,21.08) 67.68,21.08 67.05,21.72 67.05,33.66 65.62,35.09 42.57,35.09 40.89,33.4 31.11,33.4 29.58,34.93 U3.10
  Bottom Layer w0.4: v4(67.76,21.08) 69.53,19.31 78.35,19.31 80.26,21.21 80.26,22.48 81.65,23.88 动量轮1.1
PA7: length 71.1
  Top Layer w0.4: U3.9 32.12,38.2 32.79,38.86 56.89,38.86 59.17,36.58 66.41,36.58 68.57,34.42 v4(68.57,19.18)
  Bottom Layer w0.4: v4(68.57,19.18) 69.46,18.29 79.24,18.29 81.02,20.07 81.02,20.63 81.72,21.34 动量轮1.2
PA8: length 80.3
  Top Layer w0.4: v2(78.22,46.1) 78.22,50.04 76.95,51.31 56.25,51.31 55.39,52.17 55.39,53.98 55.11,54.26 42.69,54.26 42.41,53.98 42.41,52.44 U2.5 ; NOREF#6.1 78.22,17.82 78.22,32.39 79.37,33.53 v2(79.37,41.15)
  Bottom Layer w0.4: v2(79.37,41.15) 79.37,44.96 v2(78.22,46.1) ; NOREF#6.1 78.6,16 80.89,13.72 动量轮1.5
PA9: length 22.4
  Bottom Layer w0.4: U2.6 39.72,49.81 41,48.53 41,30.59 TB1.1
PA10: length 66.8
  Top Layer w0.4: v2(20.82,34.67) 25.39,34.67 25.77,35.05 25.77,37.59 26.79,38.61 28.69,38.61 29.46,39.37 v2(29.46,40.39)
  Bottom Layer w0.4: U2.7 37.18,50.27 35.68,48.77 31.11,48.77 29.46,47.12 v2(29.46,40.39) ; v2(20.82,34.67) 20.31,34.16 16.5,34.16 15.33,32.99 15.33,11.22 12.89,8.78 12.89,5.9 13.83,4.95 H1.7
PA11: length 58.8
  Top Layer w0.4: v4(28.57,49.66) 28.82,49.91 33.65,49.91 34.64,50.91 U2.8
  Bottom Layer w0.4: H1.8 14.09,8.89 16.25,11.05 16.25,24.39 17.01,25.15 18.41,25.15 23.11,29.85 23.11,35.95 23.22,36.06 23.22,37.1 23.11,37.2 23.11,39.88 25.01,41.78 28.06,41.78 28.57,42.29 v4(28.57,49.66)
PB0: length 58.1
  Top Layer w0.4: 6.47,4.95 7.64,3.78 8.48,3.78 8.83,3.43 27.04,3.43 27.68,4.06 27.68,24.26 30.22,26.8 30.22,27.56 33.39,30.73 v2(34.16,30.73)
  Bottom Layer w0.4: 34.66,36.58 34.66,30.99 34.41,30.73 v2(34.16,30.73)
PB1: length 66.4
  Top Layer w0.4: 6.47,7.49 6.24,7.27 5.1,7.27 4.82,6.99 4.82,3.81 5.83,2.79 28.31,2.79 29.07,3.56 29.07,22.73 v2(36.95,30.61)
  Bottom Layer w0.4: v2(36.95,30.61) 37.2,30.86 37.2,36.58
PB3: length 63.2
  Top Layer w0.4: U2.11 27.02,50.27 26.66,49.91 24.25,49.91 23.97,49.63 23.97,47.91 23.68,47.63 19.71,47.63 v4(19.42,47.34) ; v4(19.42,44.32) 19.42,41.28 18.41,40.26 13.83,40.26 13.07,39.5 13.07,33.53 14.34,32.26 14.34,11.05 12.32,9.02 10.67,9.02 10.28,8.64 10.28,6.22 H1.3
  Bottom Layer w0.4: v4(19.42,47.34) v4(19.42,44.32)
PB4: length 61.5
  Top Layer w0.4: v2(17.52,47.37) 18.79,48.64 22.71,48.64 23.11,49.04 23.11,50.91 U2.12 ; H1.4 8.88,7.37 8.75,7.37 8.6,7.52 8.6,9.24 9.39,10.03 11.93,10.03 13.45,11.56 13.45,32 10.52,34.94 10.52,41.39 11.17,42.04 16.95,42.04 17.23,42.32 17.23,43.91 v2(17.52,44.19)
  Bottom Layer w0.4: v2(17.52,47.37) v2(17.52,44.19)
PB5: length 56.1
  Top Layer w0.4: 6050.1 7.99,13.21 9.64,13.21 12.06,15.62 12.06,31.5 7.99,35.56 7.99,42.67 9.64,44.32 v2(16.38,44.32) ; U2.13 21.71,52.06 21.71,49.81 21.43,49.53 17.82,49.53 v2(16.38,48.09)
  Bottom Layer w0.4: v2(16.38,48.09) v2(16.38,44.32)
PB6: length 55.7
  Top Layer w0.4: 6050.6 7.64,24.99 9.08,24.99 9.36,25.27 9.36,31.78 8.4,32.74 2.56,32.74 1.77,33.53 1.77,53.09 3.17,54.48 17.21,54.48 19.4,52.29
PB7: length 54.3
  Top Layer w0.4: 6050.5 9.74,22.73 10.79,23.78 10.79,31.5 7.61,34.67 3.04,34.67 2.66,35.05 2.66,53.09 3.31,53.74 15.41,53.74 U2.15
PB8: length 110.8
  Top Layer w0.4: 动量轮1.6 83.84,12.73 83.84,42.77 83.56,43.05 79.49,43.05 75.18,47.37 63.75,47.37 62.22,48.9 35.17,48.9 32.62,46.35 15.24,46.35 14.34,47.25 14.34,52.27 U2.16
PB9: length 99.7
  Top Layer w0.4: U2.17 11.78,46.25 12.44,45.59 35.69,45.59 38.36,42.93 64,42.93 67.81,39.12 73.4,39.12 76.7,35.81 76.7,17.53 77.97,16.26 动量轮1.4
PB10: length 65.2
  Top Layer w0.4: U3.6 39.87,36.7 39.87,38.1 40.13,38.36 53.96,38.36 v4(54.86,37.47) ; OLED1.3 72.79,4.54 72.79,5.95 72.39,6.35 67.18,6.35 65.02,8.51 v2(65.02,24.51)
  Bottom Layer w0.4: v4(54.86,37.47) 56.51,35.81 64.38,35.81 65.02,35.18 v2(65.02,24.51)
PB11: length 61
  Top Layer w0.4: v2(63.87,12.7) 63.52,13.05 v2(63.52,24.64)
  Bottom Layer w0.4: v2(63.87,12.7) 64.51,12.07 73.27,12.07 75.43,9.91 OLED1.4 ; U3.5 45.2,33.66 46.6,33.66 47.49,32.77 63.11,32.77 63.52,32.36 v2(63.52,24.64)
PB12: length 112.3
  Top Layer w0.4: v2(62.22,20.45) 62.22,32.62 62.62,33.02 v2(66.05,33.02)
  Bottom Layer w0.4: U2.1 52.42,44.6 53.84,43.18 64.89,43.18 66.29,41.78 66.29,33.25 v2(66.05,33.02) ; v2(62.22,20.45) 61.97,20.19 61.97,17.27 60.7,16 53.84,16 51.88,14.04 32.14,14.04 30.85,12.75 30.85,4.7 30.47,4.32 20.23,4.32 19.67,3.75 13.53,3.75 13.03,4.26 12.5,4.26 11.8,4.95 H1.5
PB13: length 80.1
  Top Layer w0.4: U2.2 49.78,52.18 49.78,50.19 49.38,49.78 38.47,49.78 NOREF#17.1 ; v2(20.95,6.35) 20.82,6.22 12.82,6.22 H1.6 ; v2(29.84,6.48) 29.84,7.24 30.22,7.62 30.22,22.35 37.46,29.59 v2(38.22,29.59)
  Bottom Layer w0.4: NOREF#17.1 38.28,49.59 38.28,40.7 38.22,40.64 38.22,37.33 38.46,37.1 38.46,36.06 38.22,35.82 v2(38.22,29.59) ; v2(20.95,6.35) 29.71,6.35 v2(29.84,6.48)
PB14: length 108
  Bottom Layer w0.4: U2.3 47.34,53.98 46.58,54.74 3.67,54.74 1.01,52.07 1.01,35.69 0.5,35.18 0.5,6.6 2.28,4.83 4.18,4.83 4.47,5.11 4.47,10.77 2.79,12.45
PB15: length 87.5
  Bottom Layer w0.4: U2.4 43.12,53.98 3.93,53.98 2.53,52.58 2.53,40.51 1.9,39.88 1.9,34.42 1.14,33.66 1.14,11.43 2.79,9.91
PC13: length 63.3
  Inner2 w0.4: 模式一.2 12.16,1.4 12.16,3.02 12.44,3.3 21.2,3.3 28.72,10.83 28.72,13.18 27.93,13.97 22.3,13.97 R41k1.1 21.58,14.69 21.58,16.38 20.82,17.15 16.38,17.15 14.98,18.54 14.98,27.18 10.28,31.88 8.37,31.88 6.72,33.53 6.72,36.58
PC14: length 62.7
  Inner2 w0.4: 二.2 20.82,1.4 30.47,11.05 32.74,11.05 33.14,11.45 R51K1.1 33.01,12.53 33.01,17.27 31.23,19.05 17.26,19.05 16.63,19.69 16.63,27.94 11.55,33.02 9.52,33.02 9.26,33.28 9.26,36.58
PC15: length 60.2
  Inner2 w0.4: 11.8,36.58 12.44,35.94 12.44,33.91 13.96,32.39 27.3,32.39 30.09,29.59 30.09,23.11 35.17,18.03 35.17,16.26 35.81,15.62 35.81,12.53 R61k1.1 35.93,10.67 35.3,10.03 31.36,10.03 28.57,7.24 28.57,1.65 28.06,1.14 模式三.2

## Copper pours and planes (outline as drawn; the poured copper is in the pictures)
GND on Top Layer: -3.22,56.26 89.65,56.26 90.03,55.88 90.03,0.89 86.73,-2.41 65.27,-2.41 62.98,-0.13 62.98,11.42 62.73,11.67 62.09,11.04 62.09,9.91 54.47,9.91 53.71,10.67 49.78,10.67 49.65,10.54 49.16,10.54 49.16,3.79 49.65,3.3 62.22,3.3 61.97,3.05 61.97,-0.38 45.97,-0.38 44.82,0.76 44.82,8.38 44.57,8.64 33.01,8.64 32.88,8.76 32.88,3.94 33.27,3.56 43.64,3.56 43.77,3.43 43.77,0.34 43.68,0.25 -2.04,0.25 -2.29,0 -3.22,0.93
GND on Bottom Layer: -1.39,57.02 86.61,57.02 87.5,56.14 87.5,2.29 84.96,-0.25 63.37,-0.25 62.48,0.64 62.48,11.43 62.22,11.69 48.63,11.69 48.25,12.07 48.25,-1.14 48.12,-1.27 46.6,0.25 45.01,0.25 44.82,9.02 44.95,9.14 33.52,9.14 33.52,8.21 32.87,7.56 33.02,4.44 42.45,4.44 43.69,0.38 -2.29,0.38 -2.29,56.11
GND on Inner2: 55.62,9.65 62.6,9.65 65.4,6.86 65.4,5.97 68.06,5.97 69.08,4.95 69.08,2.86 55.68,2.86 54.86,3.68 54.86,8.89

Small or netless copper shapes (teardrops, artwork), in the pictures only: 51 on Top Layer, 50 on Bottom Layer, 99 on Inner1, 22 on Inner2

## Text on the board
Top Silkscreen Layer: PB0 | PB1 | PB4 | PB3 | PB13 | PB12 | PA11 | PA10 | GND | 5V | 3.3V | OLED1 | 12V | 关 | 开
